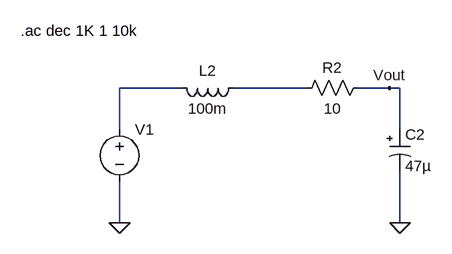
[diagram p0: schematic frequencySweep.asc]
frequencySweep.asc, the LTspice schematic file:
Version 4
SHEET 1 880 680
WIRE 240 208 144 208
WIRE 432 208 320 208
WIRE 560 208 512 208
WIRE 576 208 560 208
WIRE 144 272 144 208
WIRE 576 272 576 208
WIRE 144 416 144 352
WIRE 576 416 576 336
FLAG 576 416 0
FLAG 144 416 0
FLAG 560 208 Vout
SYMBOL res 528 192 R90
WINDOW 0 0 56 VBottom 2
WINDOW 3 32 56 VTop 2
SYMATTR InstName R2
SYMATTR Value 10
SYMBOL ind 336 192 R90
WINDOW 0 5 56 VBottom 2
WINDOW 3 32 56 VTop 2
SYMATTR InstName L2
SYMATTR Value 100m
SYMBOL polcap 560 272 R0
SYMATTR InstName C2
SYMATTR Value 47µ
SYMBOL voltage 144 256 R0
SYMATTR InstName V1
SYMATTR Value ""
SYMATTR Value2 AC 1 0
TEXT -8 120 Left 2 !.ac dec 1K 1 10k

The netlist it stands for:
* frequencySweep.asc
R2 Vout N002 10
L2 N002 N001 100m
C2 Vout 0 47µ
V1 N001 0 AC 1 0
.ac dec 1K 1 10k
.backanno
.end